# EAGLE design Gadget-Box (EAGLE 6.6.0)

## Sheet 1 of 3
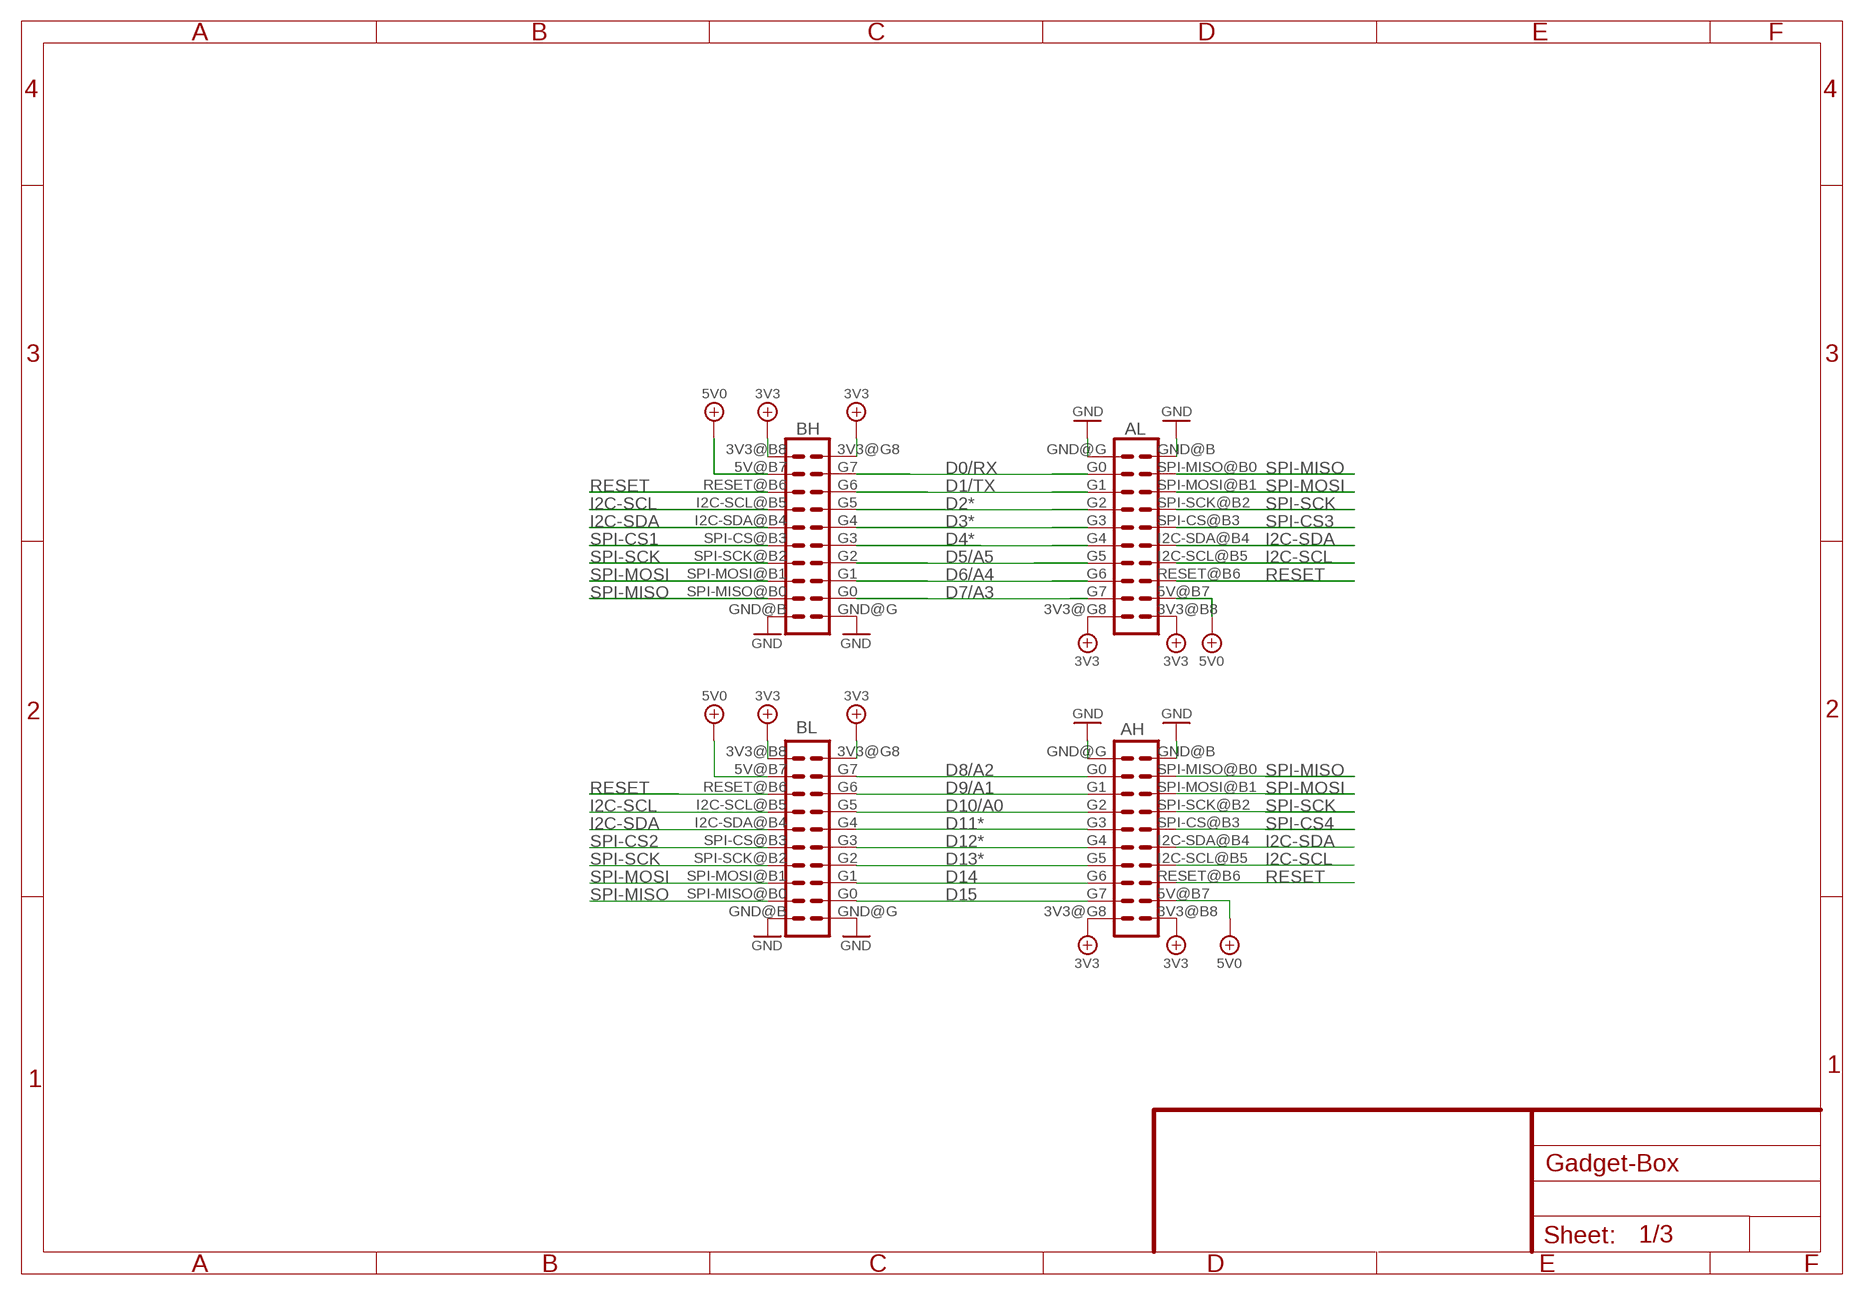
[diagram p0: schematic, sheet 1]

### Parts
AH  ECOGECOG_SLOT  [ECOG]
AL  ECOGECOG_SLOT  [ECOG]
BH  ECOGECOG_SLOT  [ECOG]
BL  ECOGECOG_SLOT  [ECOG]

### Nets
3V3: AH.3V3@B8(3V3) AH.3V3@G8(3V3) AL.3V3@B8(3V3) AL.3V3@G8(3V3) BH.3V3@B8(3V3) BH.3V3@G8(3V3) BL.3V3@B8(3V3) BL.3V3@G8(3V3) ; also sheet 2,3
D0/RX: AL.G0 BH.G7 ; also sheet 2
D1/TX: AL.G1 BH.G6 ; also sheet 2
D2*: AL.G2 BH.G5 ; also sheet 2
D3*: AL.G3 BH.G4 ; also sheet 2
D4*: AL.G4 BH.G3 ; also sheet 2
D5/A5: AL.G5 BH.G2 ; also sheet 2,3
D6/A4: AL.G6 BH.G1 ; also sheet 2
D7/A3: AL.G7 BH.G0 ; also sheet 2
D8/A2: AH.G0 BL.G7 ; also sheet 2
D9/A1: AH.G1 BL.G6 ; also sheet 2
D10/A0: AH.G2 BL.G5 ; also sheet 2
D11*: AH.G3 BL.G4 ; also sheet 2
D12*: AH.G4 BL.G3 ; also sheet 2
D13*: AH.G5 BL.G2 ; also sheet 2
D14: AH.G6 BL.G1 ; also sheet 2
D15: AH.G7 BL.G0 ; also sheet 2
GND [gnd]: AH.GND@B(GND) AH.GND@G(GND) AL.GND@B(GND) AL.GND@G(GND) BH.GND@B(GND) BH.GND@G(GND) BL.GND@B(GND) BL.GND@G(GND) ; also sheet 2,3
I2C-SCL: AH.I2C-SCL@B5(I2C-SCL) AL.I2C-SCL@B5(I2C-SCL) BH.I2C-SCL@B5(I2C-SCL) BL.I2C-SCL@B5(I2C-SCL) ; also sheet 2
I2C-SDA: AH.I2C-SDA@B4(I2C-SDA) AL.I2C-SDA@B4(I2C-SDA) BH.I2C-SDA@B4(I2C-SDA) BL.I2C-SDA@B4(I2C-SDA) ; also sheet 2
RESET: AH.RESET@B6(RESET) AL.RESET@B6(RESET) BH.RESET@B6(RESET) BL.RESET@B6(RESET) ; also sheet 2
SPI-CS1: BH.SPI-CS@B3(SPI-CS) ; also sheet 2
SPI-CS2: BL.SPI-CS@B3(SPI-CS) ; also sheet 2
SPI-CS3: AL.SPI-CS@B3(SPI-CS) ; also sheet 2
SPI-CS4: AH.SPI-CS@B3(SPI-CS) ; also sheet 2
SPI-MISO: AH.SPI-MISO@B0(SPI-MISO) AL.SPI-MISO@B0(SPI-MISO) BH.SPI-MISO@B0(SPI-MISO) BL.SPI-MISO@B0(SPI-MISO) ; also sheet 2
SPI-MOSI: AH.SPI-MOSI@B1(SPI-MOSI) AL.SPI-MOSI@B1(SPI-MOSI) BH.SPI-MOSI@B1(SPI-MOSI) BL.SPI-MOSI@B1(SPI-MOSI) ; also sheet 2
SPI-SCK: AH.SPI-SCK@B2(SPI-SCK) AL.SPI-SCK@B2(SPI-SCK) BH.SPI-SCK@B2(SPI-SCK) BL.SPI-SCK@B2(SPI-SCK) ; also sheet 2
VBUS: AH.5V@B7(5V) AL.5V@B7(5V) BH.5V@B7(5V) BL.5V@B7(5V) ; supply symbol labelled 5V0 ; also sheet 2,3

## Sheet 2 of 3
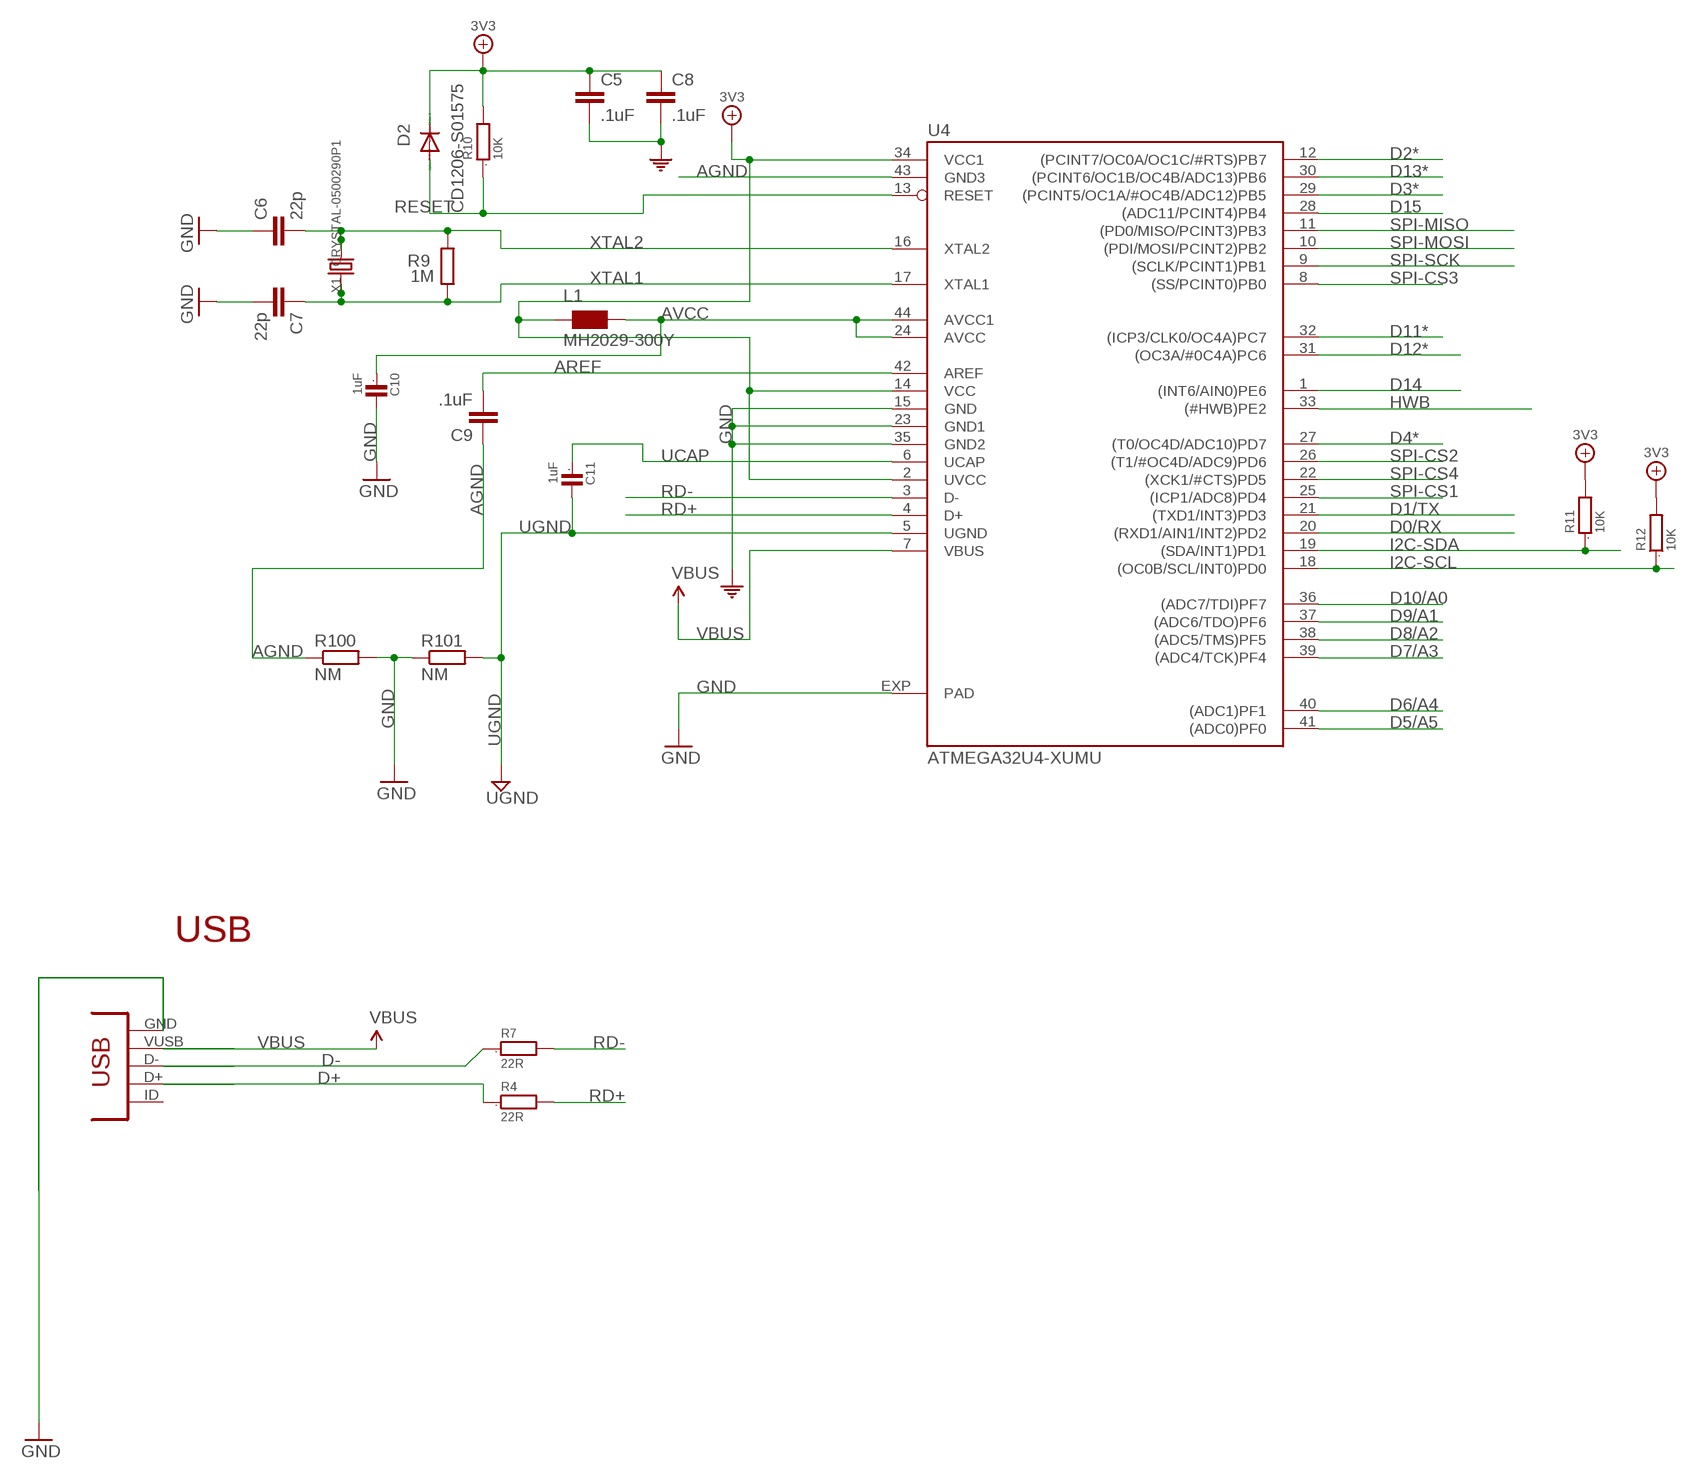
[diagram p1: schematic, sheet 2, part 1 of 2]
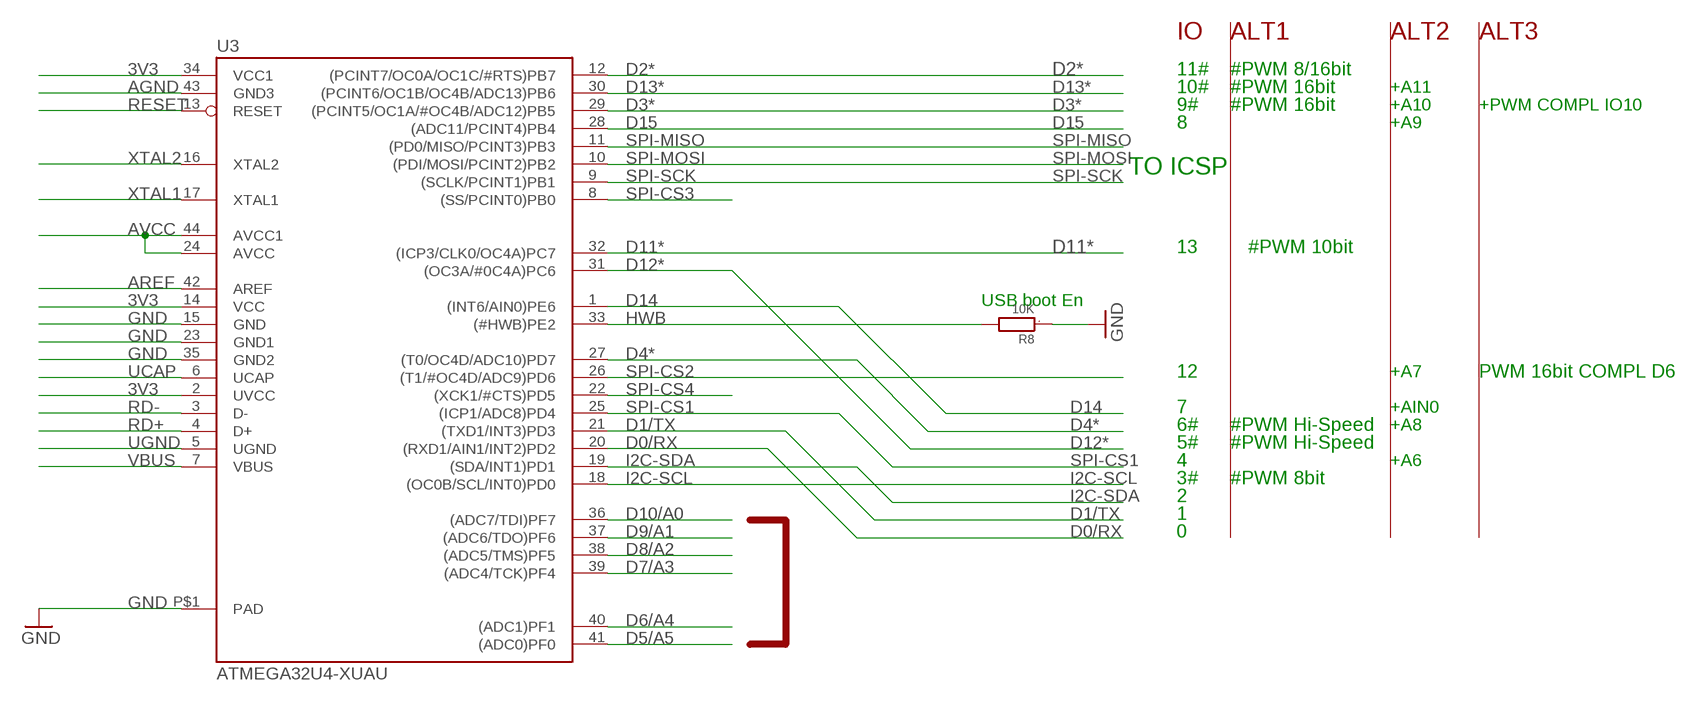
[diagram p2: schematic, sheet 2, part 2 of 2]

### Parts
C5  .1uF  C-EUC0603  [C0603-ROUND]
C6  22p  C-EUC0603  [C0603-ROUND]
C7  22p  C-EUC0603  [C0603-ROUND]
C8  .1uF  C-EUC0603  [C0603-ROUND]
C9  .1uF  C-EUC0603  [C0603-ROUND]
C10  1uF  C0603  [0603]
C11  1uF  C0603  [0603]
D2  CD1206-S01575  DIODE-MINIMELF  [MINIMELF]
L1  MH2029-300Y  WE-CBF_0805  [0805]
R4  22R  R0805  [0805]
R7  22R  R0805  [0805]
R8  10K  R0603  [0603]
R9  1M  R-EU_R0603  [R0603-ROUND]
R10  10K  R0603  [0603]
R11  10K  R0603  [0603]
R12  10K  R0603  [0603]
R100  NM  R-EU_R0402  [R0402]
R101  NM  R-EU_R0402  [R0402]
U3  ATMEGA32U4-XUAU  [TQFP44-PAD]
U4  ATMEGA32U4-XUMU  [QFN44ML7X7]
USB  CONN_USB  [CONN_USB_MINI-B]
X1  CRYSTAL-0500290P1  [2P-SMD-5.0X3.2]

### Nets
3V3: C5.1 C8.1 D2.C L1.1 R10.2 R11.2 R12.2 U3.2(UVCC) U3.14(VCC) U3.34(VCC1) U4.2(UVCC) U4.14(VCC) U4.34(VCC1) ; also sheet 1,3
AGND: C9.1 R100.1 U3.43(GND3) U4.43(GND3)
AREF [aref]: C9.2 U3.42(AREF) U4.42(AREF)
AVCC: C10.1 L1.2 U3.24(AVCC) U3.44(AVCC1) U4.24(AVCC) U4.44(AVCC1)
D0/RX: U3.20((RXD1/AIN1/INT2)PD2) U4.20((RXD1/AIN1/INT2)PD2) ; also sheet 1
D1/TX: U3.21((TXD1/INT3)PD3) U4.21((TXD1/INT3)PD3) ; also sheet 1
D2*: U3.12((PCINT7/OC0A/OC1C/#RTS)PB7) U4.12((PCINT7/OC0A/OC1C/#RTS)PB7) ; also sheet 1
D3*: U3.29((PCINT5/OC1A/#OC4B/ADC12)PB5) U4.29((PCINT5/OC1A/#OC4B/ADC12)PB5) ; also sheet 1
D4*: U3.27((T0/OC4D/ADC10)PD7) U4.27((T0/OC4D/ADC10)PD7) ; also sheet 1
D5/A5: U3.41((ADC0)PF0) U4.41((ADC0)PF0) ; also sheet 1,3
D6/A4: U3.40((ADC1)PF1) U4.40((ADC1)PF1) ; also sheet 1
D7/A3: U3.39((ADC4/TCK)PF4) U4.39((ADC4/TCK)PF4) ; also sheet 1
D8/A2: U3.38((ADC5/TMS)PF5) U4.38((ADC5/TMS)PF5) ; also sheet 1
D9/A1: U3.37((ADC6/TDO)PF6) U4.37((ADC6/TDO)PF6) ; also sheet 1
D10/A0: U3.36((ADC7/TDI)PF7) U4.36((ADC7/TDI)PF7) ; also sheet 1
D11*: U3.32((ICP3/CLK0/OC4A)PC7) U4.32((ICP3/CLK0/OC4A)PC7) ; also sheet 1
D12*: U3.31((OC3A/#0C4A)PC6) U4.31((OC3A/#0C4A)PC6) ; also sheet 1
D13*: U3.30((PCINT6/OC1B/OC4B/ADC13)PB6) U4.30((PCINT6/OC1B/OC4B/ADC13)PB6) ; also sheet 1
D14: U3.1((INT6/AIN0)PE6) U4.1((INT6/AIN0)PE6) ; also sheet 1
D15: U3.28((ADC11/PCINT4)PB4) U4.28((ADC11/PCINT4)PB4) ; also sheet 1
D+: R4.1 USB.D+
D-: R7.1 USB.D-
GND [gnd]: C5.2 C6.1 C7.2 C8.2 C10.2 R8.1 R100.2 R101.1 U3.15(GND) U3.23(GND1) U3.35(GND2) U3.P$1(PAD) U4.15(GND) U4.23(GND1) U4.35(GND2) U4.EXP(PAD) USB.GND ; supply symbol labelled COM ; also sheet 1,3
HWB: R8.2 U3.33((#HWB)PE2) U4.33((#HWB)PE2)
I2C-SCL: R12.1 U3.18((OC0B/SCL/INT0)PD0) U4.18((OC0B/SCL/INT0)PD0) ; also sheet 1
I2C-SDA: R11.1 U3.19((SDA/INT1)PD1) U4.19((SDA/INT1)PD1) ; also sheet 1
RD+: R4.2 U3.4(D+) U4.4(D+)
RD-: R7.2 U3.3(D-) U4.3(D-)
RESET: D2.A R10.1 U3.13(RESET) U4.13(RESET) ; also sheet 1
SPI-CS1: U3.25((ICP1/ADC8)PD4) U4.25((ICP1/ADC8)PD4) ; also sheet 1
SPI-CS2: U3.26((T1/#OC4D/ADC9)PD6) U4.26((T1/#OC4D/ADC9)PD6) ; also sheet 1
SPI-CS3: U3.8((SS/PCINT0)PB0) U4.8((SS/PCINT0)PB0) ; also sheet 1
SPI-CS4: U3.22((XCK1/#CTS)PD5) U4.22((XCK1/#CTS)PD5) ; also sheet 1
SPI-MISO: U3.11((PD0/MISO/PCINT3)PB3) U4.11((PD0/MISO/PCINT3)PB3) ; also sheet 1
SPI-MOSI: U3.10((PDI/MOSI/PCINT2)PB2) U4.10((PDI/MOSI/PCINT2)PB2) ; also sheet 1
SPI-SCK: U3.9((SCLK/PCINT1)PB1) U4.9((SCLK/PCINT1)PB1) ; also sheet 1
UCAP: C11.1 U3.6(UCAP) U4.6(UCAP)
UGND [gnd]: C11.2 R101.2 U3.5(UGND) U4.5(UGND)
VBUS: U3.7(VBUS) U4.7(VBUS) USB.VUSB ; also sheet 1,3
XTAL1: C7.1 R9.1 U3.17(XTAL1) U4.17(XTAL1) X1.1
XTAL2: C6.2 R9.2 U3.16(XTAL2) U4.16(XTAL2) X1.2
Unconnected: USB.BODY@1(BODY) USB.BODY@2(BODY) USB.BODY@3(BODY) USB.BODY@4(BODY) USB.ID(USBID)

### Notes on the sheet
- IO | ALT1 | ALT2 | ALT3
- 11# | #PWM 8/16bit
- 10# | #PWM 16bit | +A11
- 9# | #PWM 16bit | +A10 | +PWM COMPL IO10
- 8 | +A9
- TO ICSP
- 13 | #PWM 10bit
- USB boot En
- 12 | +A7 | PWM 16bit COMPL D6
- 7 | +AIN0
- 6# | #PWM Hi-Speed | +A8
- 5# | #PWM Hi-Speed
- 4 | +A6
- 3# | #PWM 8bit
- 2
- 1
- 0
- USB

## Sheet 3 of 3
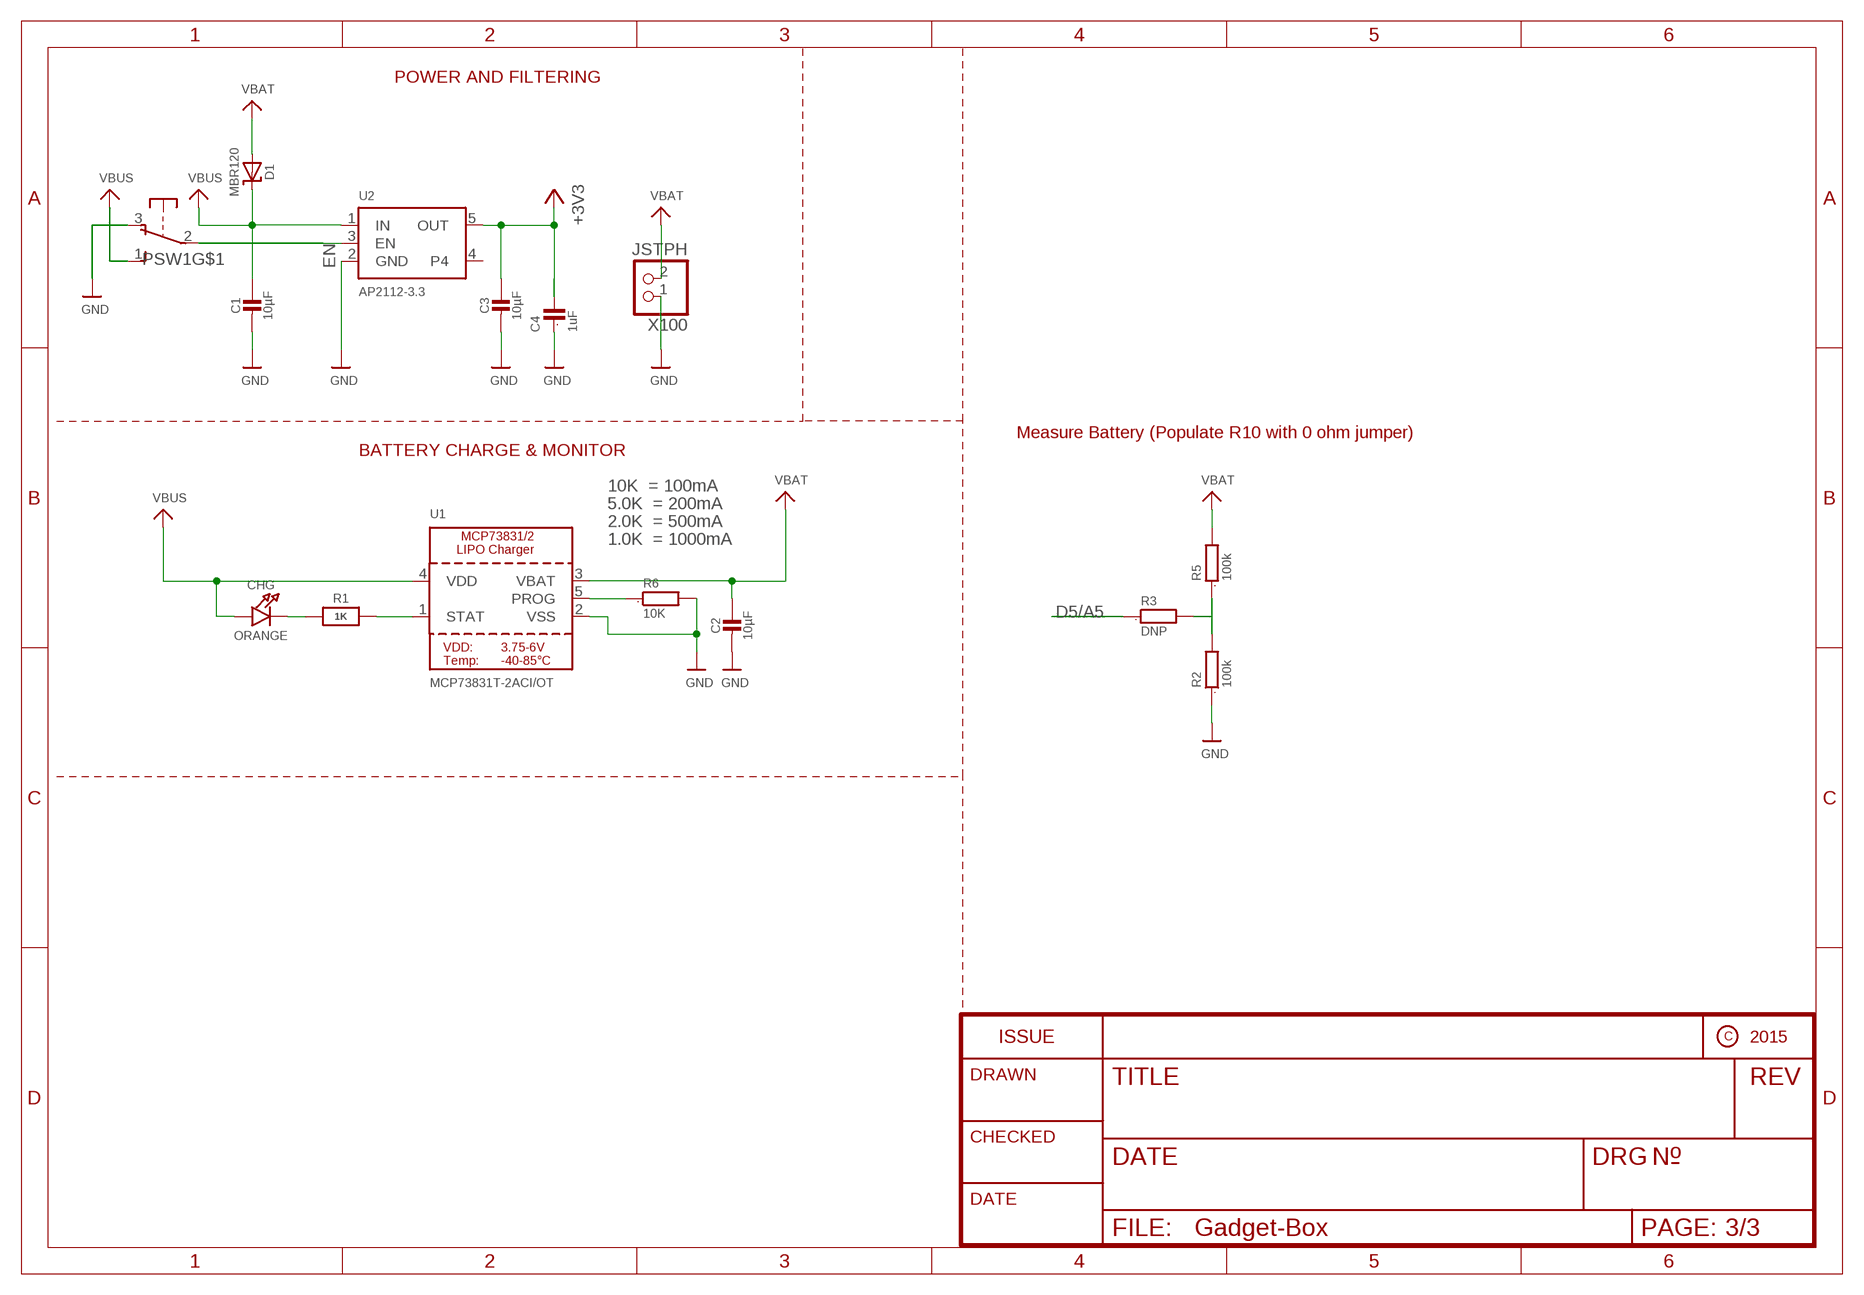
[diagram p3: schematic, sheet 3]

### Parts
C1  10µF  CAP_CERAMIC0805-NOOUTLINE  [0805-NO]
C2  10µF  CAP_CERAMIC0805-NOOUTLINE  [0805-NO]
C3  10µF  CAP_CERAMIC0805-NOOUTLINE  [0805-NO]
C4  1uF  C0603  [0603]
CHG  ORANGE  LED0805_NOOUTLINE  [CHIPLED_0805_NOOUTLINE]
D1  MBR120  DIODE-SCHOTTKYSOD-123  [SOD-123]
PSW1  OS102011MA1Q  [OS102011MA1Q]
R1  1K  RESISTOR_0603_NOOUT  [0603-NO]
R2  100k  R0603  [0603]
R3  DNP  R0603  [0603]
R5  100k  R0603  [0603]
R6  10K  R0603  [0603]
U1  MCP73831T-2ACI/OT  MCP73831/2  [SOT23-5]
U2  AP2112-3.3  VREG_SOT23-5  [SOT23-5]
X100  JSTPH  CON_JST_PH_2PIN  [JSTPH2]

### Nets
3V3: C3.1 C4.2 U2.5(OUT) ; supply symbol labelled +3V3 ; also sheet 1,2
D5/A5: R3.1 ; also sheet 1,2
EN: PSW1.2(P) U2.3(EN)
GND [gnd]: C1.2 C2.2 C3.2 C4.1 PSW1.3(O) R2.1 R6.2 U1.2(VSS) U2.2(GND) X100.1 ; also sheet 1,2
N$1: CHG.C R1.1
N$2: R2.2 R3.2 R5.1
N$3: R1.2 U1.1(STAT)
N$4: R6.1 U1.5(PROG)
VBAT: C2.1 D1.A R5.2 U1.3(VBAT) X100.2
VBUS: C1.1 CHG.A D1.C PSW1.1(S) U1.4(VDD) U2.1(IN) ; also sheet 1,2
Unconnected: PSW1.MT1(MT) PSW1.MT2(MT) U2.4

### Notes on the sheet
- POWER AND FILTERING
- Measure Battery (Populate R10 with 0 ohm jumper)
- BATTERY CHARGE & MONITOR
- 10K  = 100mA
- 5.0K  = 200mA
- 2.0K  = 500mA
- 1.0K  = 1000mA

## Library data of the parts
AH AL BH BL = eCogs:ECOG; PARTNO: PPPC102LFBN-RC,SULLINS CONNECTOR SOLUTIONS,dk,S6106-ND,"CONN HEADER FEM 20POS.1"" DL GOLD", REF67
C1-C3 = microbuilder:CAP_CERAMIC: Ceramic Capacitors For new designs, use the packages preceded by an '_' character since they are more reliable: The following footprints should be used on most boards: _0402 - Standard footprint for regular board layouts _0603 - Standard footprint for regular board layouts _0805 - Standard footprint for regular board layouts _1206 - Standard footprint for regular board layouts For extremely tight-pitch boards where space is at a premium, the following 'micro-pitch' footprints can be used (smaller pads, no silkscreen outline, etc.): _0402MP - Micro-pitch footprint for very dense/compact boards _0603MP - Micro-pitch footprint for very dense/compact boards _0805MP - Micro-pitch footprint for very dense/compact boards _1206MP - Micro-pitch footprint for very dense/compact boards; PARTNO: CL21F106ZPFNNNE,Samsung,DK,1276-3012-1-ND,CAP CER 10UF 10V Y5V 0805, REF1
C4 C10 C11 = GadgetFactory:C: CAPACITOR, European symbol; PARTNO: C1608X5R1A105K080AC,TDK CORPORATION (VA),dk,445-1321-1-ND,CAP CER 1UF 10V X5R 0603, REF53
C5 C8 C9 = SmartPrj:C-EU: CAPACITOR, European symbol; PARTNO: GRM188F51E104ZA01D,MURATA ELECTRONICS (VA),DK,490-1575-1-ND,CAP CER .1UF 25V Y5V 0603, REF2
C6 C7 = SmartPrj:C-EU: CAPACITOR, European symbol; PARTNO: C1608C0G1H220J080AA,TDK CORPORATION (VA),dk,445-1273-1-ND,CAP CER 22PF 50V C0G 0603, REF58
CHG = microbuilder:LED: LED 0603 - 0603 Surface Mount Package 2mA: Green LED - Low Power (3.9mcd, 2ma, 1.7Vf) - Digikey: 475-2709-2-ND Orange LED - Low Power (9.8mcd, 2ma, 1.8Vf) - Digikey: 475-1194-2-ND Red LED - Low Power (5mcd, 2ma, 1.8Vf) - Digikey: 475-1195-2-ND Yellow LED - Low Power (7mcd, 2ma, 1.8Vf) - Digikey: 475-1196-2-ND 5mA: Blue LED - Low Power (17mcd, 5ma, 2.9Vf) - Digikey: LNJ937W8CRACT-ND 0805 - 0805 Surface Mount Package 2mA: Red LED (8.8mcd, 2mA, 1.8Vf, Clear) - Low Power [Digikey: 475-2510-1-ND] Green LED (5mcd, 2mA, 1.8Vf, Clear) - Low Power [Digikey: 475-2730-1-ND] Yellow LED (11.3mcd, 2mA, 1.8Vf, Clear) - Low Power [Digikey: 475-2555-1-ND] 20mA: Red LED (104mcd, 20mA, Diffused) - LS R976 [Digikey: 475-1278-6-ND] Red LED (12mcd, 20mA, 2.0Vf, Clear) - APT2012EC [Digikey: 754-1128-1-ND] Green LED (15mcd, 20mA, 2.2Vf, Clear) - APT2012GC [Digikey: 754-1131-1-ND] Orange LED (160mcd, 20mA, 2.1Vf, Clear) - APT2012SECK [Digikey: 754-1130-1-ND] 1206 - 1206 Surface Mount Package Green LED (26mcd, 20mA, Diffused) - LG N971 [Digikey: 475-1407-6-ND] Red LED (15mcd, 20mA, Diffused) - LH N974 [Digikey: 475-1416-6-ND] Cree - Cree High-Power Surface Mount LEDs XPEBWT-L1-0000-00D50 - White 111lm 350mA 2.9Vf 6200K 110° XTEAWT-00-0000-00000LEE3 - White 114lm 350mA 2.85Vf 5000K 115° Everlight - Everlight 45-21 Series Surface Mount LEDs 45-21/QK2C-B2832AC2CB2/2T - Warm White 2000mcd 20mA 3.25Vf 3050K 120° 45-21/LK2C-B38452C4CB2/2T - Nuetral White 2000mcd 20mA 3.25Vf 4150K 120° 45-21/LK2C-B50634C6CB2/2T - Cold White 2200mcd 20mA 3.25Vf 5650K 120° PLCC2 Reverse Mount LS T77K-J1L2-1-0-2-R18-Z - Red 11.25mcd 2mA 1.8Vf 630nm 120° LO T77K-L1M2-24-Z - Orange 19.6mcd 2mA 1.8Vf 606nm 120° LY T77K-K2M1-26-Z - Yellow 15.7mcd 2mA 1.8Vf 587nm 120°; PARTNO: LTST-C171EKT,LITE-ON INC (VA),DK,160-1422-1-ND,LED RED ORAN CLEAR THIN 0805 SMD, REF6
D1 = microbuilder:DIODE-SCHOTTKY; PARTNO: MBR120VLSFT3G,on semiconductor,dk,MBR120VLSFT3GOSCT-ND ,DIODE SCHOTTKY 20V 1A SOD123FL , REF71
D2 = diode:DIODE-: DIODE; PARTNO: CD1206-S01575,BOURNS INC (VA),dk,CD1206-S01575CT-ND,DIODE GEN PURP 100V 150MA 1206, REF46
L1 = wuerth-elektronik:WE-CBF: SMD EMI Suppression Ferrite Beads - excellent anti-EMI properties - low DCR - impedances till 3000 ohms - rated current up to 6 A; PARTNO: MH2029-300Y,BOURNS INC (VA),dk,MH2029-300YCT-ND,FERRITE BEAD 30 OHM 0805 1LN, REF60
PSW1 = adafruit:OS102011MA1Q: OS10201MA1Q through-hole right angle switch http://www.ladyada.net/library/eagle; PARTNO: OS102011MA1QN1,C&K Components,dk,CKN9559-ND,SWITCH SLIDE SPDT 100MA 12V , REF72
R1 = microbuilder:RESISTOR: Resistors For new designs, use the packages preceded by an '_' character since they are more reliable: The following footprints should be used on most boards: _0402 - Standard footprint for regular board layouts _0603 - Standard footprint for regular board layouts _0805 - Standard footprint for regular board layouts _1206 - Standard footprint for regular board layouts For extremely tight-pitch boards where space is at a premium, the following 'micro-pitch' footprints can be used (smaller pads, no silkscreen outline, etc.): _0402MP - Micro-pitch footprint for very dense/compact boards _0603MP - Micro-pitch footprint for very dense/compact boards _0805MP - Micro-pitch footprint for very dense/compact boards _1206MP - Micro-pitch footprint for very dense/compact boards; PARTNO: RC0603JR-071KL,YAGEO (VA),dk,311-1.0KGRTR-ND,RES SMD 1K OHM 5% 1/10W 0603 , REF73
R2 R5 = GadgetFactory:R: RESISTOR, European symbol; PARTNO: RC0603JR-07100KL,YAGEO (VA),dk,311-100KGRCT-ND,RES SMD 100K OHM 5% 1/10W 0603 , REF76
R3 = GadgetFactory:R: RESISTOR, European symbol; BOM: EXCLUDE
R4 R7 = GadgetFactory_6.0:R: RESISTOR, European symbol; PARTNO: RMCF0805JT22R0,STACKPOLE ELECTRONICS INC (VA),dk,RMCF0805JT22R0CT-ND,RES SMD 22 OHM 5% 1/8W 0805, REF62
R6 R11 R12 = GadgetFactory:R: RESISTOR, European symbol; PARTNO: RC0603JR-0710KL,YAGEO (VA),dk,311-10KGRCT-ND,RES SMD 10K OHM 5% 1/10W 0603 , REF36
R8 R10 = GadgetFactory_6.0:R: RESISTOR, European symbol; PARTNO: RC0603JR-0710KL,YAGEO (VA),dk,311-10KGRCT-ND,RES SMD 10K OHM 5% 1/10W 0603 , REF36
R9 = SmartPrj:R-EU_: RESISTOR, European symbol; PARTNO: RMCF0603JT1M00,STACKPOLE ELECTRONICS INC (VA),dk,RMCF0603JT1M00CT-ND,RES SMD 1M OHM 5% 1/10W 0603, REF57
R100 R101 = SmartPrj:R-EU_: RESISTOR, European symbol; BOM: EXCLUDE
U1 = microbuilder:MCP73831/2: MCP73831/2 LIPO Charger VDD: 3.75 - 6V Temp -40 - 85°C Programmable Charge Rate: 15-500mA NOTE: STAT is a tri-state logic output on the MCP73831 and an open-drain output on the MCP73832. SOT23-5 with 4.2V output and tri-state logic on STAT = MCP73831T-2ACI/OT; PARTNO: MCP73831T-2ACI/OT,MICROCHIP TECHNOLOGY (VA),dk,MCP73831T-2ACI/OTCT-ND,IC CONTROLLR LI-ION 4.2V SOT23-5, REF74
U2 = microbuilder:VREG_SOT23-5: SOT23-5 Fixed Voltage Regulators Part Current Out V Out V In V Dropout θJA (°C/W) TJ (°C) Digikey Part No. ADP121 150mA 3.3V 3.4-5.5V 0.09V @ 150mA -- -- ADP121-AUJZ33R7CT-ND ADP121 150mA 3.0V 3.1-5.5V 0.09V @ 150mA -- -- ADP121-AUJZ30R7CT-ND ADP122 300mA 3.3V 3.4-5.5V 0.085V @ 300mA -- -- ADP122AUJZ-3.3-R7CT-ND ADP1712 300mA 3.3V 3.5-5.5V 0.17V @ 300mA -- -- ADP1712AUJZ-3.3-R7TR-ND AP7311 (Low Cost) 150mA 3.3V 3.5-6V 0.15V @ 150mA -- -- AP7311-33WG-7DICT-ND LD39015M18R 150mA 1.8V 1.9V-5.5V 0.08V @ 100mA -- -- 497-6977-1-ND LP2985A-33DBVR 150mA 3.3V 3.3-16V 0.28V @ 150mA 206 150 296-18479-1-ND MCP1824T-3302E/OT 300mA 3.3V 3.5V-6V 0.2V @ 300mA -- -- MCP1824T-3302E/OTCT-ND MIC5205-2.5YM5 TR 150mA 2.5V 2.7-16V 0.165V @ 150mA -- -- 576-1257-2-ND MIC5205-3.0YM5 TR 150mA 3.0V 3.2V-16V 0.165V @ 150mA -- -- 576-1258-2-ND MIC5205-3.3YM5 TR 150mA 3.3V 3.5V-16V 0.165V @ 150mA -- -- 576-1259-2-ND TPS780330220 150mA 3.3V+2.2V 3.6-5.5V 250mV Max -- -- 296-23332-1-ND TDA3663/N1,135 100mA 3.3V 3.5-45V 0.18V @ 50mA -- -- 568-5343-1-ND Max operating temp can be calculated using θJA, TJ (max junction temperature), and power in watts. Set the "Maximum Ambient Temperature" until it reaches TJ ("Max Junction Temperature"), which is the absolute limit for safe use of the regulator: Heat Sink Temperature Calculator <http://www.daycounter.com/Calculators/Heat-Sink-Temperature-Calculator.phtml> For example, With 12V source into a 3.3V LP2985 and a 30mA load, we are dissipating (12V-3.3V) * 0.03A = 0.261W. With a θJA of 206 °C/W, a TJ of 150°C, and 261mW we can safely use the chip without a heat sink up to 75°C (=147.1°C Junction Temperature).; PARTNO: AP2112K-3.3TRG1,Diodes Incorporated,dk,AP2112K-3.3TRG1DICT-ND,IC REG LDO 3.3V 0.6A SOT25 , REF75
U3 = SmartPrj:ATMEGA32U4-XU; PARTNO: ATMEGA32U4-AUR,ATMEL (VA),dk,ATMEGA32U4-AURCT-ND,IC MCU 8BIT 32KB FLASH 44TQFP, REF48
U4 = SmartPrj:ATMEGA32U4-XU; BOM: EXCLUDE
USB = dp_devices:CONN_USB: USB connector; PARTNO: USB-M26FTR,ON SHORE TECHNOLOGY INC (VA),dk,ED2992CT-ND,CONN USB MINI B R/A SMD, REF66
X1 = OPL Eagle Library:CRYSTAL*; PARTNO: ABM3-8.000MHZ-D2Y-T,Abracon Corporation,dk,535-10630-1-ND ,CRYSTAL 8.0000MHZ 18PF SMD , REF70
X100 = microbuilder:CON_JST_PH_2PIN: JST 2-Pin Right-Angle Connector PH-Series - 4UConnector: 17311 SH-Series - 4UConnector: 07278; PARTNO: S2B-PH-SM4-TB(LF)(SN),JST SALES AMERICA INC (VA),dk,455-1749-1-ND,CONN HEADER PH SIDE 2POS 2MM SMD, REF69

## Net classes
2 gnd: width 0.254 mm, drill 0.381 mm, clearance 0.254 mm
3 usbvcc: width 0.254 mm, drill 0.381 mm, clearance 0.254 mm
4 aref: width 0.254 mm, drill 0.381 mm, clearance 0.254 mm

## Board
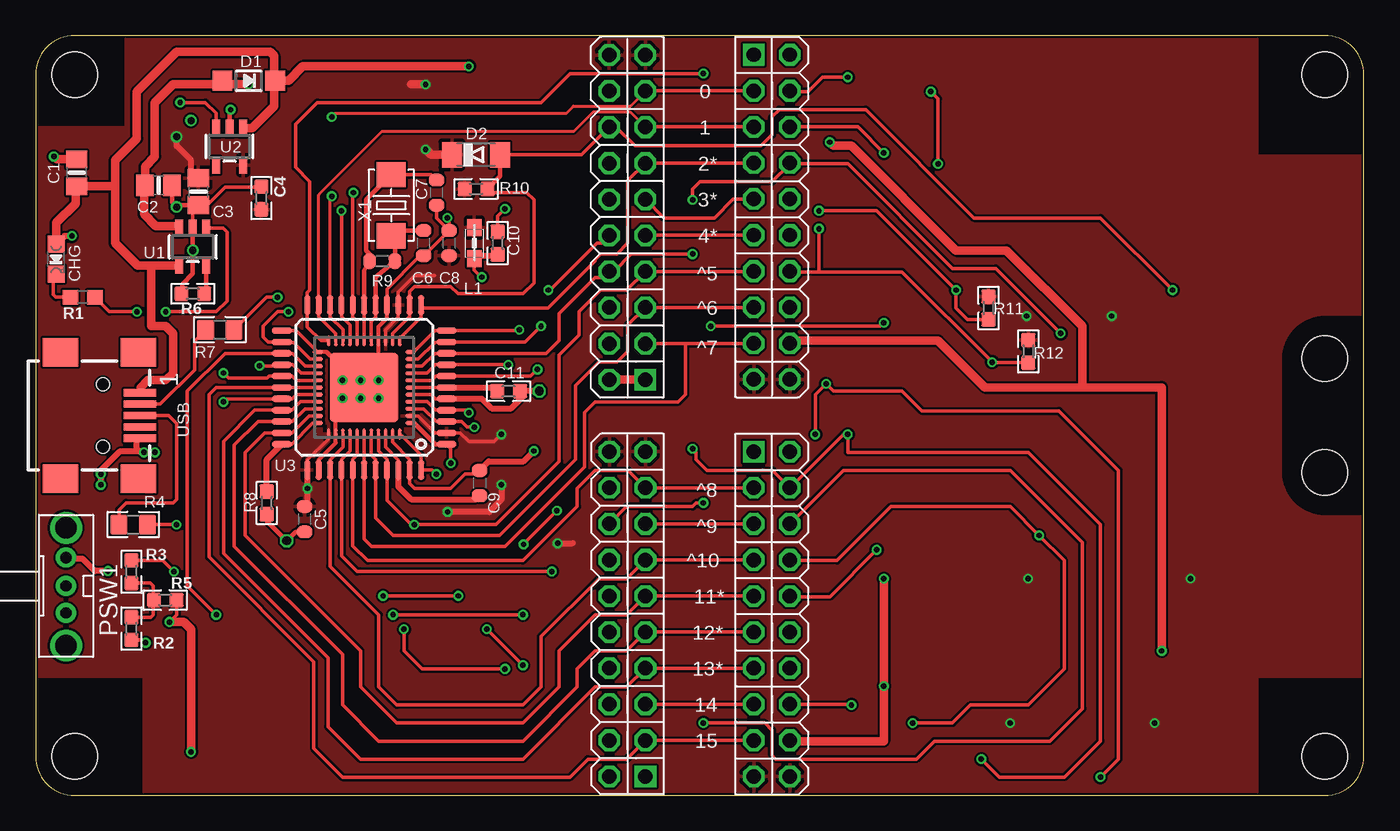
[diagram p4: board, top side]
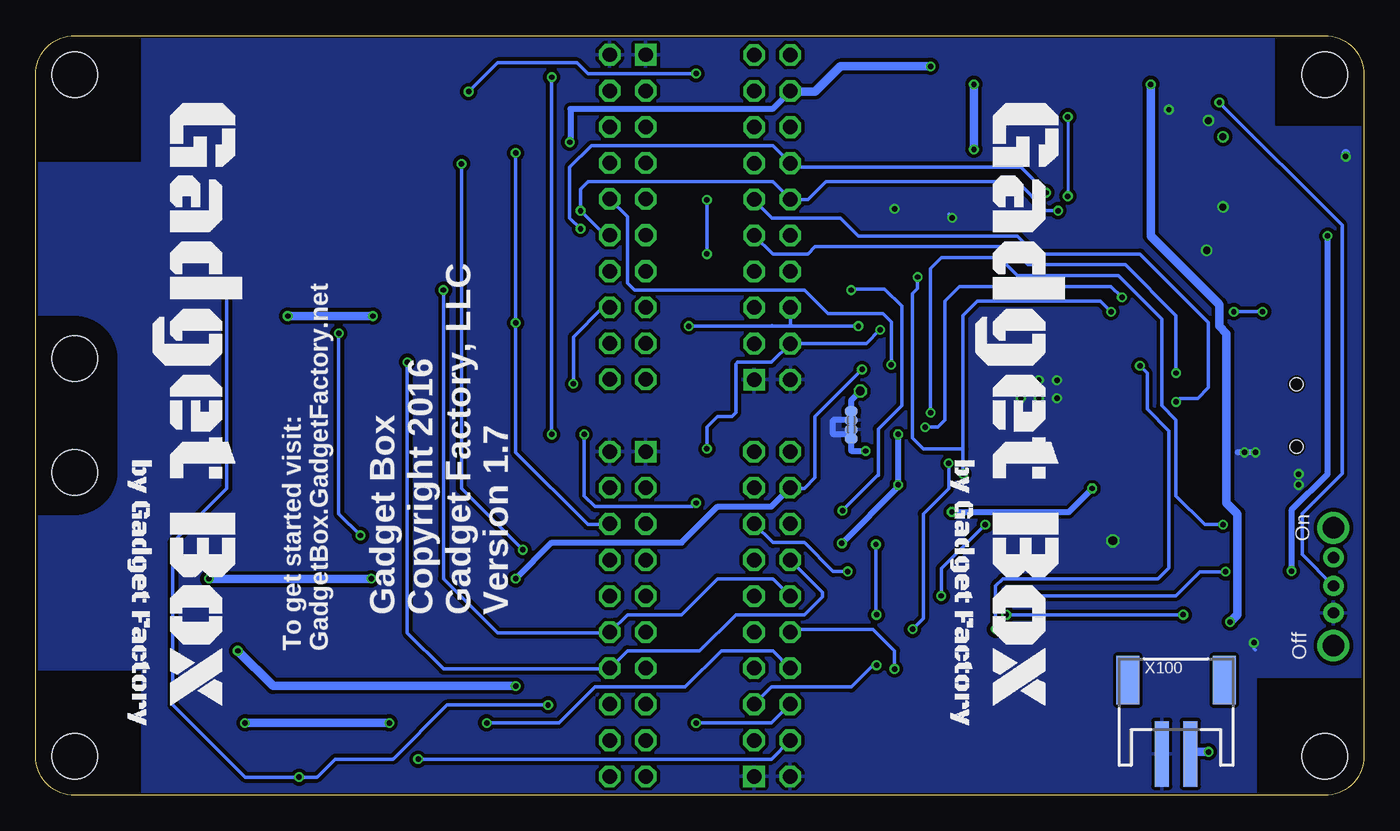
[diagram p5: board, bottom side, seen from below]

Size 93.5 x 53.5 mm. Coordinates in mm from the lower left corner, seen from the top.
Copper layers (1*16): Top 0.035mm / dielectric 1.5mm / Bottom 0.035mm
Design rules "hackvana *": minimum track width 6mil, minimum drill 0.3mm, track to track 6mil, track to pad 6mil, pad to pad 6mil, via to via 6mil, smd to smd 0mil, copper to edge 6mil, drill to drill 6mil, minimum pad ring 10mil, minimum via ring 6mil, stop-mask expansion 2mil, vias tented up to drill 100mil, thermal gap 10mil

### Footprints (pad centres in the part's own frame; a part is rotated, then mirrored left to right if it is on the bottom)
ECOG93P53P5 = hole 3.2: 4,4; 92,4; 92,52; 4,52; 92,24; 92,32
ECOG = drill 1.016 octagon: 3V3@B8 21.59,3.81; 3V3@G8 21.59,1.27; 5V@B7 19.05,3.81; G0 1.27,1.27; G1 3.81,1.27; G2 6.35,1.27; G3 8.89,1.27; G4 11.43,1.27; G5 13.97,1.27; G6 16.51,1.27; G7 19.05,1.27; GND@B -1.27,3.81; I2C-SCL@B5 13.97,3.81; I2C-SDA@B4 11.43,3.81; RESET@B6 16.51,3.81; SPI-CS@B3 8.89,3.81; SPI-MISO@B0 1.27,3.81; SPI-MOSI@B1 3.81,3.81; SPI-SCK@B2 6.35,3.81 | drill 1.016 square: GND@G -1.27,1.27
0805-NO = smd 1.24 x 1.5: 1 -0.95,0; 2 0.95,0
0603 = smd 1 x 1: 1 -0.8,0; 2 0.8,0
C0603-ROUND = smd 0.898 x 1.1: 1 -0.889,0; 2 0.889,0
CHIPLED_0805_NOOUTLINE = smd 1.2 x 1.2: A 0,-1.05; C 0,1.05
SOD-123 = smd 1.4 x 1.4: A 1.85,0; C -1.85,0
MINIMELF = smd 1.4 x 1.8: A 1.7,0; C -1.7,0
0805 = smd 1.2 x 1: 1 -1.1,0; 2 1.1,0
OS102011MA1Q = drill 0.8 pad 1.422: 1 -2,0; 2 0,0; 3 1.9,0 | drill 1.5 pad 2.184: MT1 -4.1,0; MT2 4.2,0
0603-NO = smd 1.1 x 1: 1 -0.85,0; 2 0.85,0
0805' = smd 1.2 x 1.4: 1 -1,0; 2 1,0
R0603-ROUND = smd 0.898 x 1.1: 1 -0.889,0; 2 0.889,0
R0402 = smd 0.7 x 0.9: 1 -0.65,0; 2 0.65,0
SOT23-5 = smd 0.55 x 1.2: 1 -0.95,-1.3; 2 0,-1.3; 3 0.95,-1.3; 4 0.95,1.3; 5 -0.95,1.3
TQFP44-PAD = smd 1.4 x 0.45: 1 -5.8,4; 2 -5.8,3.2; 3 -5.8,2.4; 4 -5.8,1.6; 5 -5.8,0.8; 6 -5.8,0; 7 -5.8,-0.8; 8 -5.8,-1.6; 9 -5.8,-2.4; 10 -5.8,-3.2; 11 -5.8,-4; 23 5.8,-4; 24 5.8,-3.2; 25 5.8,-2.4; 26 5.8,-1.6; 27 5.8,-0.8; 28 5.8,0; 29 5.8,0.8; 30 5.8,1.6; 31 5.8,2.4; 32 5.8,3.2; 33 5.8,4 | smd 0.45 x 1.4: 12 -4,-5.8; 13 -3.2,-5.8; 14 -2.4,-5.8; 15 -1.6,-5.8; 16 -0.8,-5.8; 17 0,-5.8; 18 0.8,-5.8; 19 1.6,-5.8; 20 2.4,-5.8; 21 3.2,-5.8; 22 4,-5.8; 34 4,5.8; 35 3.2,5.8; 36 2.4,5.8; 37 1.6,5.8; 38 0.8,5.8; 39 0,5.8; 40 -0.8,5.8; 41 -1.6,5.8; 42 -2.4,5.8; 43 -3.2,5.8; 44 -4,5.8 | smd 1 x 1: P$1 0,0
QFN44ML7X7 = smd 0.75 x 0.275: 1 -3.275,2.5; 2 -3.275,2; 3 -3.275,1.5; 4 -3.275,1; 5 -3.275,0.5; 6 -3.275,0; 7 -3.275,-0.5; 8 -3.275,-1; 9 -3.275,-1.5; 10 -3.275,-2; 11 -3.275,-2.5; 23 3.275,-2.5; 24 3.275,-2; 25 3.275,-1.5; 26 3.275,-1; 27 3.275,-0.5; 28 3.275,0; 29 3.275,0.5; 30 3.275,1; 31 3.275,1.5; 32 3.275,2; 33 3.275,2.5 | smd 0.275 x 0.75: 12 -2.5,-3.275; 13 -2,-3.275; 14 -1.5,-3.275; 15 -1,-3.275; 16 -0.5,-3.275; 17 0,-3.275; 18 0.5,-3.275; 19 1,-3.275; 20 1.5,-3.275; 21 2,-3.275; 22 2.5,-3.275; 34 2.5,3.275; 35 2,3.275; 36 1.5,3.275; 37 1,3.275; 38 0.5,3.275; 39 0,3.275; 40 -0.5,3.275; 41 -1,3.275; 42 -1.5,3.275; 43 -2,3.275; 44 -2.5,3.275 | smd 4.826 x 4.826: EXP 0,0
CONN_USB_MINI-B = smd 2 x 2.5: BODY@1 -4.45,2.5; BODY@2 4.45,2.5; BODY@3 4.45,-3; BODY@4 -4.45,-3 | smd 0.5 x 2.3: D+ 0,2.6; D- -0.8,2.6; GND 1.6,2.6; ID 0.8,2.6; VUSB -1.6,2.6 | hole 0.9: -2.2,0; 2.2,0
2P-SMD-5.0X3.2 = smd 1.778 x 2.032: 1 -2.159,0; 2 2.159,0
JSTPH2 = smd 1 x 4.6: 1 -1,-3.7; 2 1,-3.7 | smd 1.6 x 3.4: NC1 -3.4,1.5; NC2 3.4,1.5

### Placement (x,y rotation side)
$$U$1  [ECOG93P53P5]  -1.25,-1.25 0 top
AH  49.28,22.93 270 top
AL  49.28,50.88 270 top
BH  44.19,30.54 90 top
BL  44.2,2.61 90 top
C1  2.9,43.84 90 top
C2  8.66,42.95 0 top
C3  11.46,42.51 270 top
C4  15.89,42.06 270 top
C5  18.94,19.45 270 top
C6  27.32,38.88 90 top
C7  28.21,42.44 270 top
C8  29.1,38.88 90 top
C9  31.26,21.99 270 top
C10  32.53,38.88 90 top
C11  33.29,28.47 0 top
CHG  1.45,37.75 180 top
D1  15.01,50.31 180 top
D2  31.01,45.1 0 top
L1  30.88,38.88 270 top
PSW1  2.15,14.75 270 top
R1  3.32,35.07 0 top
R2  6.75,11.75 90 top
R3  6.75,15.75 270 top
R4  22R  [0805']  6.88,19.07 0 top
R5  9.13,13.75 0 top
R6  11.07,35.33 180 top
R7  22R  [0805']  12.97,32.79 0 top
R8  16.28,20.59 90 top
R9  24.4,37.61 0 top
R10  31.01,42.69 180 top
R11  67.08,34.31 90 top
R12  69.87,31.26 90 top
R100  36.09,25.78 90 bottom
R101  36.09,26.41 90 bottom
U1  11.07,38.63 180 top
U2  13.66,45.69 180 top
U3  23.13,28.72 180 top
U4  23.13,28.72 180 top
U$100  [GADGETBOX_TEXT]  24.4,27.45 270 bottom
U$101  [GADGETBOX_TEXT]  82.32,27.45 270 bottom
USB  4.75,26.75 270 top
X1  25.04,41.55 270 top
X100  13.23,6.62 0 bottom

### Tracks (layer width: path | path; a pad name or v marks a point on that pad's centre or on a via)
3V3  (via drill 0.38, 0.5)
  Top 0.254: U3.34 19.13,23.6 20.63,25.1 | U4.2 26.91,26.72 28.11,25.52 U3.2 29.89,25.52 30.5,24.91 32.28,24.91 v32.79,25.42 | U4.14 24.63,32.76 25.53,33.66 U3.14 25.53,35.44 26.69,36.6 28.09,36.6 | 11.59,43.33 C3.1 10.94,43.98 | U2.5 14.7,44.48
  Top 0.406: U3.34 v19.13,21.61 19.13,20.53 C5.1 | v32.79,21.86 32.79,20.82 31.92,19.96 v29,19.96 | v36.75,17.75 37.81,17.75 | 10.94,43.98 10.94,44.72 9.93,45.74 v9.93,46.38 | 14.56,44.34 U2.5
  Top 0.61: D2.C 27.83,45.1 v27.45,45.49 | v27.45,50.06 26.44,50.06
  Bottom 0.254: v32.79,21.86 32.79,21.71
  Bottom 0.406: v32.79,25.42 v32.79,21.86 | v29,19.96 20.79,19.96 v19.13,21.61 | 32.79,21.71 v36.75,17.75
  Bottom 0.61: v69.75,33.75 v75.75,33.75 | v68.6,5.1 v78.76,5.1 | v81.3,15.26 v69.87,15.26 | v27.45,45.49 v27.45,50.06
  pour Top: -1.25,8.37 -1.25,47.03 6.37,47.03 6.37,54.63 85.95,54.63 85.95,45.01 94.92,45.01 94.92,8.37 85.95,8.37 85.95,-1.25 7.64,-1.25 7.64,8.37
AGND  (via drill 0.38)
  Top 0.254: U4.43 25.13,24.87 26.33,23.67 U3.43 26.33,21.97 26.69,21.61 29.23,21.61 30.25,22.63 31.01,22.63 C9.1
  Top 0.406: v35.07,24.25 34.34,23.52 31.9,23.52 C9.1
  Bottom 0.406: R100.1 36.09,24.25 v35.07,24.25
AREF
  Top 0.254: U4.42 24.63,24.53 25.53,23.63 U3.42
  Top 0.406: U3.42 25.53,21.75 26.44,20.85 31.01,20.85 C9.2
AVCC  (via drill 0.38)
  Top 0.254: U4.44 25.65,25.45 27.13,23.96 U3.44 27.92,22.92 v28.21,22.63 | v17.8,34.06 17.04,34.06 16.02,33.04 16.02,32.28 16.38,31.92 U3.24 17.36,31.9 18.16,31.9 19.33,30.72 U4.24 | v31.41,36.49 31.39,36.52 31.34,36.52 30.88,36.98 L1.2 31.09,37.99
  Top 0.406: 31.09,37.99 32.44,37.99 C10.1
  Bottom 0.254: v28.21,22.63 28.21,24.4 | 28.21,24.4 28.21,33.8 27.2,34.82 18.56,34.82 v17.8,34.06 | v31.41,36.49 31.41,35.68 31.77,35.33 31.77,25.17 31.01,24.4 28.21,24.4
D0/RX  (via drill 0.38)
  Top 0.203: v20.85,47.77 21.1,48.03 37.36,48.03 37.87,48.53 41.86,48.53 BH.G7 | U3.20 20.73,42.07 v20.85,42.18
  Top 0.254: U4.20 21.63,32.79 20.73,33.69 U3.20 | AL.G0 42.94,49.61 BH.G7
  Bottom 0.203: v20.85,47.77 v20.85,42.18
D1/TX
  Top 0.203: U3.21 19.93,42.29 24.4,46.76 37.89,46.76 39.26,48.13 41.84,48.13 BH.G6
  Top 0.254: U4.21 21.13,32.52 19.93,33.73 U3.21 | AL.G1 42.94,47.07 BH.G6
D2*
  Top 0.254: U4.12 25.63,32.16 27.13,33.66 U3.12 | 27.18,34.56 U3.12 | U3.12 27.35,34.31 36.09,34.31 39.39,37.61 39.39,37.74 39.77,38.12 40.91,38.12 41.68,38.88 41.68,43.27 BH.G5 50.53,44.51 AL.G2
D3*  (via drill 0.38)
  Top 0.254: U4.29 18.37,28.22 18.07,27.92 U3.29 13.44,27.92 v13.23,27.71 | AL.G3 49.1,41.99 47.77,40.66 44.23,40.66 BH.G4
  Bottom 0.254: v13.23,27.71 12.97,27.96 11.7,27.96 10.94,28.72 10.94,33.29 15.77,38.12 23.13,38.12 24.4,39.39 35.58,39.39 36.85,40.66 41.68,40.66 42.92,41.9 BH.G4
D4*  (via drill 0.38)
  Top 0.254: U4.27 18.37,29.22 18.07,29.52 U3.27 16.44,29.52 16.3,29.38 13.58,29.38 v13.23,29.74 13.44,29.52 | AL.G4 42.94,39.45 BH.G3
  Bottom 0.254: v13.23,29.74 13.23,33.8 16.78,37.36 23.64,37.36 24.91,38.63 38.63,38.63 39.14,38.12 41.61,38.12 BH.G3
D5/A5  (via drill 0.38)
  Top 0.254: U4.41 24.13,24.24 24.73,23.64 U3.41 24.73,20.77 26.44,19.07 v26.65,19.07 32.41,19.07 36.85,23.52 36.85,31.01 38.25,32.41 38.25,34.06 39.77,35.58 41.61,35.58 BH.G2 50.53,36.89 AL.G5 | R3.1 8.95,16.55 v9.75,15.75 | v24.46,14.05 v29.75,14.05
  Bottom 0.254: v9.75,15.75 11.55,15.75 13.25,14.05 v24.46,14.05 | v29.75,14.05 29.75,15.97 v26.65,19.07
D6/A4
  Top 0.254: U4.40 23.63,23.95 23.93,23.66 U3.40 23.93,19.54 25.17,18.31 32.66,18.31 37.99,23.64 37.99,28.85 39.64,30.5 40.91,30.5 41.68,31.26 41.68,33.11 BH.G1 50.53,34.35 AL.G6
D7/A3
  Top 0.254: U4.39 U3.39 23.13,18.05 23.64,17.55 33.04,17.55 38.63,23.13 38.63,26.94 39.39,27.71 45.23,27.71 45.74,28.21 45.74,31.81 | BH.G0 45.74,31.81 | 45.74,31.81 50.53,31.81 AL.G7
D8/A2
  Top 0.254: U4.38 22.63,23.95 22.33,23.66 U3.38 22.33,17.58 23.39,16.53 34.31,16.53 38.12,20.34 38.12,21.61 39.39,22.88 41.71,22.88 BL.G7 AH.G0
D9/A1  (via drill 0.38)
  Top 0.254: U4.37 22.13,24.24 21.53,23.64 U3.37 21.53,16.86 22.63,15.77 v36.34,15.77 | BL.G6 AH.G1
  Bottom 0.254: BL.G6 41.61,17.8 39.39,17.8 37.36,15.77 v36.34,15.77
D10/A0
  Top 0.254: U4.36 21.63,24.53 20.73,23.63 U3.36 20.73,16.14 24.15,12.72 24.15,7.64 25.42,6.37 34.31,6.37 35.58,7.64 35.58,11.2 39.64,15.26 41.61,15.26 BL.G5 AH.G2
D11*
  Top 0.254: U4.32 19.25,26.72 18.05,25.52 U3.32 16.12,25.52 14.75,24.15 14.75,18.31 22.88,10.18 22.88,7.64 25.42,5.1 34.31,5.1 36.85,7.64 36.85,10.18 39.39,12.72 41.61,12.72 BL.G4 AH.G3
D12*
  Top 0.254: U4.31 18.97,27.22 18.07,26.32 U3.31 15.65,26.32 13.99,24.66 13.99,17.55 21.61,9.93 21.61,6.37 24.15,3.83 34.31,3.83 38.12,7.64 38.12,8.91 39.39,10.18 41.61,10.18 BL.G3 AH.G4
D13*
  Top 0.254: U4.30 18.65,27.72 18.05,27.12 U3.30 15.44,27.12 13.23,24.91 13.23,17.04 20.59,9.67 20.59,4.85 22.88,2.56 34.31,2.56 39.39,7.64 41.61,7.64 BL.G2 AH.G5
D14  (via drill 0.38)
  Top 0.254: v29.23,23.39 29.23,24.43 U3.1 | v31.77,11.7 v34.31,9.16 | BL.G1 AH.G6
  Top 0.305: U4.1 26.65,26.22 28.15,24.72 U3.1
  Bottom 0.254: v29.23,23.39 29.23,21.61 31.01,19.83 31.01,12.47 v31.77,11.7 | v34.31,9.16 34.56,9.16 36.09,7.64 41.71,7.64 BL.G1
D15
  Top 0.254: U4.28 U3.28 12.72,28.72 12.21,28.21 12.21,16.78 19.58,9.42 19.58,3.32 21.61,1.29 37.61,1.29 38.88,2.56 41.61,2.56 BL.G0 AH.G7
D+
  Top 0.254: R4.1 5.88,20.1 6.37,20.59 9.67,20.59 9.93,20.85 9.93,26.18 9.36,26.75 USB.D+
D-
  Top 0.254: R7.1 11.2,32.01 11.2,29.97 8.78,27.55 USB.D-
EN  (via drill 0.38)
  Top 0.254: v10.18,48.79 11.96,48.79 12.71,48.04 U2.3
  Bottom 0.254: v10.18,48.79 1.54,40.15 1.54,22.66 4.35,19.85 4.35,16.95 PSW1.2
GND  (via drill 0.38, 0.5, 0.61)
  Top 0.254: U4.23 18.36,32.72 U3.23 | U3.15 24.73,35.66 26.94,37.87 27.45,37.87 C6.1 27.71,37.99 27.71,38.37 C8.2 | v24.15,29.23 24.15,29.35 23.96,29.54 | U1.2 11.07,41.55 C3.2 12.09,41.55 13.36,42.82 15.86,42.82 C4.1 | R2.1 7.55,10.95 v7.75,10.75 | C10.2 32.53,40.79 v33.04,41.3 | C7.2 28.21,40.66 C8.2 | C8.2 29.1,40.53 v28.98,40.66
  Top 0.279: U3.15 24.73,33.6 24.13,33 U4.15 24.13,29.72 | 21.13,26.72 U4.35 21.13,24.82 19.93,23.62 U3.35 | 20.48,31.22 U4.23
  Top 0.305: U3.P$1 23.96,29.54 24.13,29.72 | 21.13,26.72 U3.P$1 | 20.48,31.22 20.75,30.96 20.9,30.96 U3.P$1 | U3.P$1 25.04,26.82 | C5.2 18.31,18.56 v17.67,17.93 16.28,19.32 R8.1 | U2.2 13.66,48.2 v13.74,48.28 | C2.2 9.61,41.74 v9.93,41.42 10.06,41.55 11.07,41.55 | U1.2 v11.07,38.37 11.07,36.72 10.31,35.96 10.31,35.36 R6.2
  Top 0.406: v7.64,24.15 7.7,24.21 7.33,24.21 | 7.33,24.21 7.13,24.4 7.13,24.93 USB.GND | 7.33,24.21 5.92,24.21 4.59,22.88 v4.59,22.63 v4.59,21.86
  Top 0.61: BH.GND@B BH.GND@G | C1.2 1.48,44.79 v1.29,44.98
  Bottom 0.254: v33.04,41.3 33.04,41.55 | v7.75,10.75 7.75,10.35 7.65,10.25 | v28.98,40.66 29.23,40.91
  Bottom 0.305: v13.74,48.28 13.74,48.53
  Bottom 0.406: v7.64,24.15 v8.4,24.15 8.91,24.15 | R101.1 R100.2 37.36,26.43 37.36,25.42 36.09,25.42 R101.1
  Bottom 0.61: v1.29,44.98 1.29,45.23
  other vias: 21.61,29.23 22.88,29.23 21.61,27.96 22.88,27.96 24.15,27.96 10.94,47.52
  pour Bottom: -1.25,8.4 -1.25,47.01 6.37,47.01 6.37,55.14 85.95,55.14 85.95,44.47 94.92,44.47 94.92,8.91 85.95,8.91 85.95,-1.76 7.64,-1.76 7.64,8.4
HWB
  Top 0.254: U4.33 19.52,26.22 18.02,24.72 U3.33 17.27,24.66
  Top 0.406: R8.2 16.28,23.66 U3.33
I2C-SCL  (via drill 0.38)
  Top 0.254: U4.18 22.63,33.36 22.33,33.66 U3.18 22.33,42.4 v22.37,42.44 | v67.33,30.5 60.98,36.85 55.19,36.85 | v67.33,30.5 67.33,30.41 | 55.19,36.85 53.15,36.85 AL.I2C-SCL@B5 | v55.14,39.9 55.14,36.9 55.19,36.85 | R12.1 67.37,30.46 v67.33,30.5
  Bottom 0.254: v22.37,42.44 24.15,44.22 40.09,44.22 BH.I2C-SCL@B5 41.61,45.74 54.38,45.74 55.9,44.22 55.9,40.66 v55.14,39.9 | v67.33,30.5 67.33,11.45 64.79,8.91 53.14,8.91 AH.I2C-SCL@B5 53.06,8.96 51.84,10.18 46.76,10.18 44.22,12.72 39.39,12.72 38.12,13.99 38.12,14.31 BL.I2C-SCL@B5
I2C-SDA  (via drill 0.38)
  Top 0.254: U4.19 22.13,33.13 21.53,33.73 U3.19 v21.53,41.17 | v55.14,41.17 59.2,41.17 v64.79,35.58 64.79,34.31 65.59,33.51 R11.1 | v21.53,41.17
  Bottom 0.254: v64.79,35.58 64.79,15.26 60.98,11.45 53.14,11.45 AH.I2C-SDA@B4 53.06,11.5 51.84,12.72 48.03,12.72 45.49,15.26 41.61,15.26 BL.I2C-SDA@B4 | 53.11,39.39 53.15,39.39 | 53.15,39.39 AL.I2C-SDA@B4 | 53.15,39.39 53.36,39.39 v55.14,41.17 55.14,42.69 54.63,43.2 41.61,43.2 BH.I2C-SDA@B4 40.34,41.93 39.14,41.93 37.87,43.2 24.4,43.2 22.37,41.17 v21.53,41.17
N$1
  Top 0.254: R1.1 1.43,35.07 1.25,35.25 1.25,36.5 CHG.C
N$2
  Top 0.254: R2.2 8.11,12.55 8.28,12.72 8.28,13.69 R5.1 8.28,13.81 8.28,14.75 8.08,14.95 R3.2
N$3  (via drill 0.38)
  Top 0.254: U1.1 13.2,39.93 13.48,39.64 13.48,34.82 12.72,34.06 v9.16,34.06 | v7.13,34.06 5.19,34.06 R1.2
  Bottom 0.254: v9.16,34.06 v7.13,34.06
N$4
  Top 0.305: U1.5 12.02,35.48 R6.1
RD+  (via drill 0.38)
  Top 0.254: U4.4 27.56,27.72 28.16,27.12 U3.4 30.32,27.12 v30.5,26.94 | v9.93,19.07 R4.2
  Bottom 0.254: v30.5,26.94 30.5,37.1 29.74,37.87 25.67,37.87 24.4,36.6 17.29,36.6 14.24,33.55 14.24,27.45 13.23,26.44 13.23,21.1 11.2,19.07 v9.93,19.07
RD-  (via drill 0.38)
  Top 0.254: U4.3 27.33,27.22 28.23,26.32 U3.3 29.98,26.32 30.37,25.93 v30.88,25.93 | v17.04,35.07 16.26,35.07 R7.2
  Bottom 0.254: v17.04,35.07 17.8,35.83 28.47,35.83 29.48,34.82 29.48,26.44 29.99,25.93 v30.88,25.93
RESET  (via drill 0.38)
  Top 0.254: U4.13 25.13,32.52 26.33,33.73 U3.13 26.33,35.48 26.69,35.83 29.23,35.83 29.74,35.33 34.31,35.33 35.07,36.09 35.07,41.93 34.56,42.44 32.06,42.44 R10.1 | v74.95,1.29 76.22,2.56 76.22,22.88 72.03,27.07 62.38,27.07 60.98,28.47 56.15,28.47 v55.65,28.98 54.88,28.21 v54.88,25.42 | v80.03,35.58 74.95,40.66 66.06,40.66 58.44,48.28 52.34,48.28 51.84,47.77 51.84,46.5 51.07,45.74 42.18,45.74 40.87,47.05 BH.RESET@B6 38.44,45.1 D2.A | AH.RESET@B6 57.37,6.42 v57.42,6.37 | v47.01,20.59 46.5,20.59 46.25,20.34 41.61,20.34 BL.RESET@B6
  Top 0.305: D2.A 32.71,43.59 R10.1
  Bottom 0.254: v80.03,35.58 80.03,21.61 83.84,17.8 83.84,6.37 78.76,1.29 v74.95,1.29 73.68,1.29 72.41,2.56 68.35,2.56 64.54,6.37 v57.42,6.37 | v55.65,28.98 55.65,32.28 53.61,34.31 53.15,34.31 AL.RESET@B6 | 40.34,47.01 BH.RESET@B6 | v54.88,25.42 54.88,21.1 54.12,20.34 47.26,20.34 v47.01,20.59
SPI-CS1  (via drill 0.38)
  Top 0.254: U4.25 18.99,30.22 18.09,31.12 U3.25 13.34,31.12 10.69,28.47 10.69,14.75 v12.72,12.72 | v34.31,12.72 v25.17,12.72 | v34.35,17.67 34.35,17.7 v36.7,20.05 | v36.09,35.58 36.22,35.58 39.52,38.88 39.83,38.88 BH.SPI-CS@B3
  Bottom 0.254: 34.18,12.85 v34.31,12.72 34.35,12.76 v34.35,17.67 | v25.17,12.72 v12.72,12.72 | v36.7,20.05 34.23,22.52 34.18,22.52 34.18,25.8 32.53,27.45 32.53,34.44 33.73,35.64 36.03,35.64 v36.09,35.58
SPI-CS2  (via drill 0.38)
  Top 0.254: U4.26 18.7,29.72 18.11,30.32 U3.26 17.26,30.25 v15.77,30.25 | v33.04,8.91 27.2,8.91 25.93,10.18 v25.93,11.7
  Bottom 0.254: v15.77,30.25 15.26,29.74 15.26,27.2 13.74,25.67 13.74,16.02 14.5,15.26 25.42,15.26 25.93,14.75 v25.93,11.7 | v33.04,8.91 33.04,10.18 34.56,11.7 40.19,11.7 BL.SPI-CS@B3
SPI-CS3  (via drill 0.38)
  Top 0.254: U4.8 27.56,29.72 28.16,30.32 U3.8 v33.27,30.32
  Bottom 0.254: v33.27,30.32 33.27,33.34 33.85,33.93 37.74,33.93 39.39,35.58 51.33,35.58 51.84,36.09 51.84,40.74 AL.SPI-CS@B3
SPI-CS4  (via drill 0.38)
  Top 0.254: 19.07,34.59 U3.22 | U3.22 19.13,35.41 19.3,35.58 19.3,43.23 18.31,44.22 18.31,47.26 19.83,48.79 35.58,48.79 37.61,50.82 v47.01,50.82 | U3.22 19.13,32.98 20.09,32.02 20.61,32.02 U4.22 | v59.2,17.29 55.9,13.99 53.14,13.99 AH.SPI-CS@B3 | v63.52,44.47 63.52,49.04 v63.01,49.55
  Bottom 0.254: v59.2,17.29 63.52,21.61 v63.52,44.47 | v47.01,50.82 54.63,50.82 55.39,51.58 60.98,51.58 v63.01,49.55
SPI-MISO  (via drill 0.38)
  Top 0.254: U4.11 26.6,31.22 28.11,32.73 U3.11 33.99,32.72 v34.06,32.79 | v46.25,24.4 46.5,24.15 46.5,23.64 47.26,22.88 51.87,22.88 AH.SPI-MISO@B0 56.85,25.42 v57.17,25.42 57.17,24.15 69.87,24.15 74.95,19.07 74.95,3.83 72.41,1.29 67.84,1.29 v66.57,2.56 | v57.17,50.57 55.39,50.57 54.38,49.55 53.15,49.55 AL.SPI-MISO@B0
  Bottom 0.254: v46.25,24.4 46.25,25.93 45.49,26.69 44.47,26.69 44.22,26.94 44.22,30.37 44.09,30.5 41.69,30.5 BH.SPI-MISO@B0 35.03,31.81 v34.06,32.79 | v66.57,2.56 41.71,2.56 BL.SPI-MISO@B0 | v57.17,25.42 v57.17,50.57
SPI-MOSI  (via drill 0.38)
  Top 0.254: U4.10 26.94,30.72 28.11,31.9 U3.10 34.46,31.92 v35.58,33.04 | v47.01,5.1 51.33,5.1 51.84,4.59 51.84,2.81 52.09,2.56 62,2.56 63.27,3.83 71.39,3.83 73.68,6.12 73.68,17.8 68.6,22.88 56.85,22.88 AH.SPI-MOSI@B1 | v47.52,33.04 59.48,33.04 v59.71,33.27 | AL.SPI-MOSI@B1 57.87,47.07 v59.71,45.23
  Bottom 0.254: v59.71,45.23 v59.71,33.27 59.71,24.15 54.63,19.07 53.14,19.07 AH.SPI-MOSI@B1 | v47.01,5.1 41.71,5.1 BL.SPI-MOSI@B1 | 41.65,33.07 41.68,33.04 | 41.68,33.04 v47.52,33.04 | v35.58,33.04 40.41,33.04 | 40.41,33.04 41.68,33.04 | BH.SPI-MOSI@B1 40.38,33.07 40.41,33.04
SPI-SCK  (via drill 0.38)
  Top 0.254: U4.9 27.23,30.22 28.12,31.12 U3.9 35.95,31.12 36.85,32.02 36.85,33.93 39.39,36.47 39.96,36.47 BH.SPI-SCK@B2 40.7,36.89 41.93,38.12 v46.25,38.12 | v61.74,5.1 64.54,5.1 65.81,6.37 69.87,6.37 72.41,8.91 72.41,16.53 v70.63,18.31 68.6,20.34 60.22,20.34 56.41,16.53 53.14,16.53 AH.SPI-SCK@B2 | v72.16,32.53 67.58,37.1 64.54,37.1 57.17,44.47 53.15,44.47 AL.SPI-SCK@B2 53.09,44.45 51.84,43.2 46.76,43.2 46.25,42.69 v46.25,41.93
  Bottom 0.254: v61.74,5.1 56.66,5.1 54.12,7.64 47.77,7.64 45.23,10.18 41.61,10.18 BL.SPI-SCK@B2 | v46.25,38.12 v46.25,41.93 | v72.16,32.53 72.16,19.83 v70.63,18.31
UCAP
  Top 0.254: U4.6 U3.6
  Top 0.406: U3.6 32.24,28.72 C11.1
UGND  (via drill 0.61)
  Top 0.254: U3.5 28.15,27.92 27.85,28.22 U4.5
  Top 0.406: v35.45,28.47 C11.2 34.18,28.38 34.18,27.96 33.47,27.25 32.1,27.25 31.43,27.92 U3.5
  Bottom 0.406: R101.2 36.09,27.83 v35.45,28.47
VBAT  (via drill 0.38)
  Top 0.254: 10.12,40.09 U1.3 | 9.55,12.34 v9.42,12.21 9.93,12.72 R5.2
  Top 0.61: 12.97,50.49 D1.A | 10.12,40.09 8.47,40.09 7.64,40.91 7.64,42.88 C2.1 7.71,44.28 8.4,44.98 8.4,48.79 9.67,50.06 12.9,50.06 D1.A | v15.01,50.06 13.41,50.06 D1.A | v9.42,12.21 10.43,12.21 10.94,11.7 v10.94,3.07
  Bottom 0.61: v15.01,50.06 15.01,39.39 10.18,34.56 10.18,33.04 9.67,32.53 9.67,20.59 8.91,19.83 8.91,12.72 v9.42,12.21 | v10.94,3.07 12.08,3.07 X100.2
VBUS  (via drill 0.38)
  Top 0.254: 10.12,37.55 U1.4 10.12,37.29 | U4.7 27.88,29.22 28.18,29.52 U3.7 34.86,29.52 v35.33,29.99
  Top 0.406: 7.39,28.39 USB.VUSB | v2.56,39.39 2.04,39.39 CHG.A | v5.1,15.8 4.18,15.8 3.32,16.66 2.24,16.66 PSW1.1
  Top 0.61: v59.71,15.26 v59.71,7.7 59.71,3.83 53.14,3.83 AH.5V@B7 | v79.27,10.18 79.27,28.72 73.68,28.72 | 73.68,28.72 66.82,28.72 63.52,32.02 53.28,32.02 AL.5V@B7 | 73.68,28.72 73.68,33.04 68.35,38.37 64.79,38.37 57.42,45.74 56.15,45.74 v55.9,45.99 | 17.04,50.49 D1.C | 10.12,37.29 8.15,37.29 | 8.15,37.29 7.2,37.29 5.61,38.88 5.61,43.07 | 7.39,28.39 7.39,28.72 7.89,29.23 9.16,29.23 9.67,29.74 9.67,32.53 9.16,33.04 8.15,33.04 8.15,37.29 | 5.61,43.07 5.61,44.72 7.13,46.25 7.13,49.55 9.93,52.34 16.53,52.34 16.78,52.09 16.78,50.38 D1.C | 5.61,43.07 5.42,42.89 C1.1 2.81,42.8 2.81,41.68 1.45,40.31 CHG.A | U2.1 15.24,46.99 16.78,48.53 16.78,50.24 D1.C | v30.5,51.33 18.82,51.33 17.8,50.31 D1.C
  Bottom 0.254: v35.33,29.99 38.63,26.69 38.63,22.37 39.39,21.61 40.34,21.61 BL.5V@B7
  Bottom 0.406: v59.71,15.26 57.17,17.8 48.03,17.8 45.49,20.34 41.71,20.34 BL.5V@B7 | 40.36,49.57 BH.5V@B7 41.64,48.33 55.85,48.33 55.85,46.05 v55.9,45.99 | v5.1,15.8 5.1,20.09 2.56,22.63 v2.56,39.39
  Bottom 0.61: v59.71,7.7 76.79,7.7 v79.27,10.18 | 40.17,49.8 BH.5V@B7 40.34,49.55 38.63,49.55 36.85,51.33 v30.5,51.33
XTAL1
  Top 0.254: U4.17 U3.17 | X1.1 27.83,43.71 C7.1
  Top 0.305: U3.17 23.13,36.96 R9.1 23.52,38.12 23.26,38.37 23.26,41.93 X1.1
XTAL2
  Top 0.254: U4.16 23.63,33.36 23.93,33.66 U3.16
  Top 0.305: U3.16 23.93,36.49 R9.2 25.29,39.14 X1.2 25.42,39.77 C6.2

### Text on the board
bPlace: Gadget Box / Copyright 2016 / Gadget Factory, LLC / Version 1.7 | To get started visit: / GadgetBox.GadgetFactory.net
tNames: 0 | 1 | 2* | 3* | 4* | ^5 | ^6 | ^7 | ^8 | ^9 | ^10 | 11* | 12* | 13* | 14 | 15
bNames: On | Off